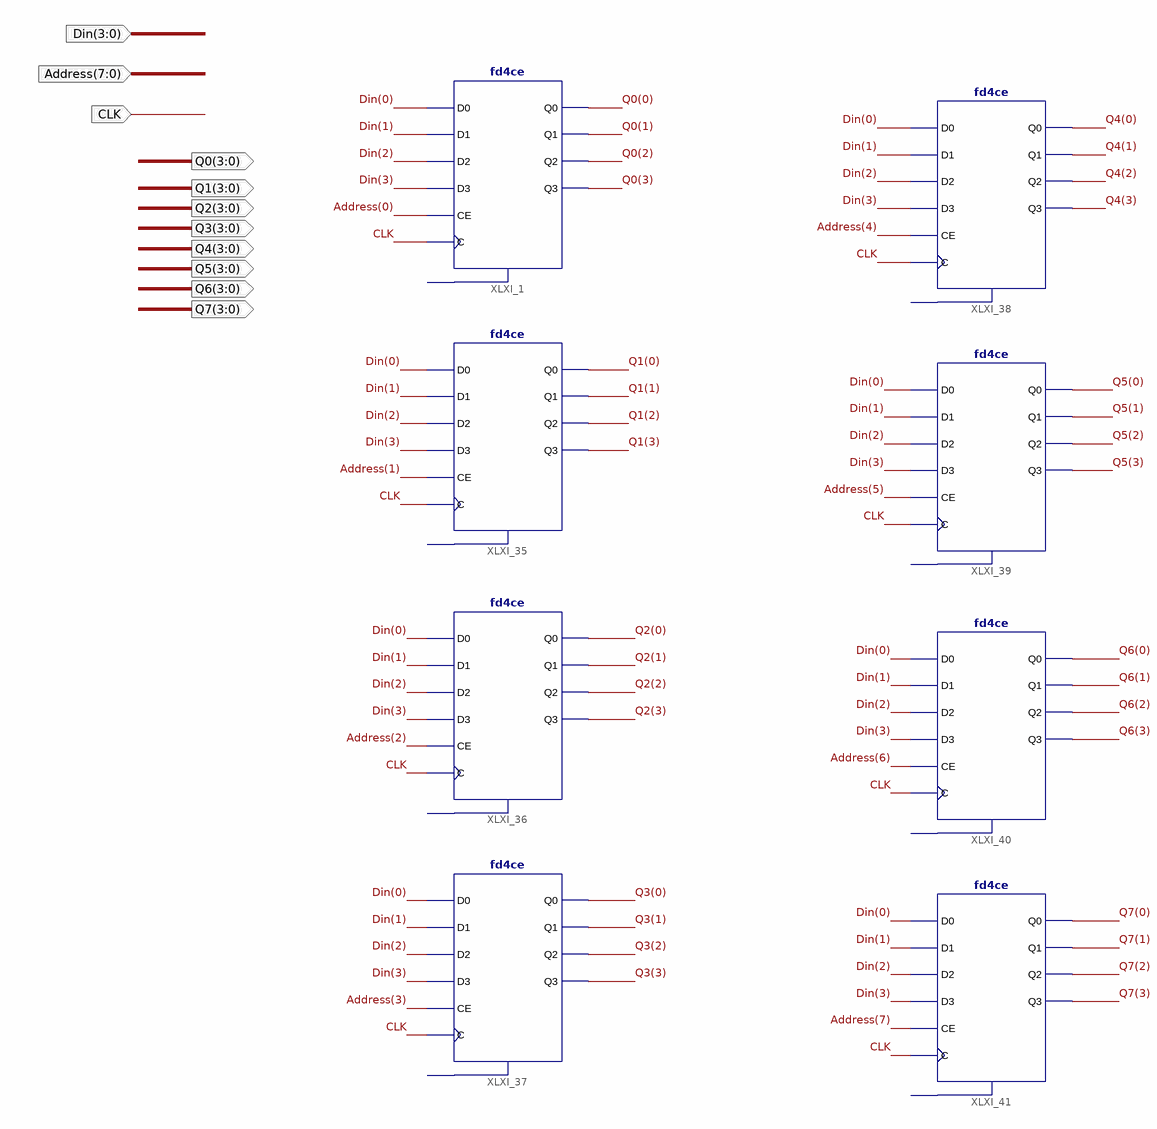
[diagram p0: schematic sheet 1]
// Xilinx ISE schematic Memory.sch (spartan3e) as structural Verilog: 8 symbols, 11 ports
module Memory (
  input  [3:0] Din,
  input  [7:0] Address,
  input  CLK,
  output [3:0] Q2,
  output [3:0] Q1,
  output [3:0] Q0,
  output [3:0] Q3,
  output [3:0] Q4,
  output [3:0] Q6,
  output [3:0] Q5,
  output [3:0] Q7
);

  fd4ce XLXI_1 (
    .C(CLK), .CE(Address[0]), .D0(Din[0]), .D1(Din[1]), .D2(Din[2]), .D3(Din[3]), .Q0(Q0[0]), .Q1(Q0[1]),
    .Q2(Q0[2]), .Q3(Q0[3]));  // open: CLR
  fd4ce XLXI_35 (
    .C(CLK), .CE(Address[1]), .D0(Din[0]), .D1(Din[1]), .D2(Din[2]), .D3(Din[3]), .Q0(Q1[0]), .Q1(Q1[1]),
    .Q2(Q1[2]), .Q3(Q1[3]));  // open: CLR
  fd4ce XLXI_36 (
    .C(CLK), .CE(Address[2]), .D0(Din[0]), .D1(Din[1]), .D2(Din[2]), .D3(Din[3]), .Q0(Q2[0]), .Q1(Q2[1]),
    .Q2(Q2[2]), .Q3(Q2[3]));  // open: CLR
  fd4ce XLXI_37 (
    .C(CLK), .CE(Address[3]), .D0(Din[0]), .D1(Din[1]), .D2(Din[2]), .D3(Din[3]), .Q0(Q3[0]), .Q1(Q3[1]),
    .Q2(Q3[2]), .Q3(Q3[3]));  // open: CLR
  fd4ce XLXI_38 (
    .C(CLK), .CE(Address[4]), .D0(Din[0]), .D1(Din[1]), .D2(Din[2]), .D3(Din[3]), .Q0(Q4[0]), .Q1(Q4[1]),
    .Q2(Q4[2]), .Q3(Q4[3]));  // open: CLR
  fd4ce XLXI_39 (
    .C(CLK), .CE(Address[5]), .D0(Din[0]), .D1(Din[1]), .D2(Din[2]), .D3(Din[3]), .Q0(Q5[0]), .Q1(Q5[1]),
    .Q2(Q5[2]), .Q3(Q5[3]));  // open: CLR
  fd4ce XLXI_40 (
    .C(CLK), .CE(Address[6]), .D0(Din[0]), .D1(Din[1]), .D2(Din[2]), .D3(Din[3]), .Q0(Q6[0]), .Q1(Q6[1]),
    .Q2(Q6[2]), .Q3(Q6[3]));  // open: CLR
  fd4ce XLXI_41 (
    .C(CLK), .CE(Address[7]), .D0(Din[0]), .D1(Din[1]), .D2(Din[2]), .D3(Din[3]), .Q0(Q7[0]), .Q1(Q7[1]),
    .Q2(Q7[2]), .Q3(Q7[3]));  // open: CLR
endmodule
